# EAGLE design MCU_v2 (EAGLE 7.1.0)
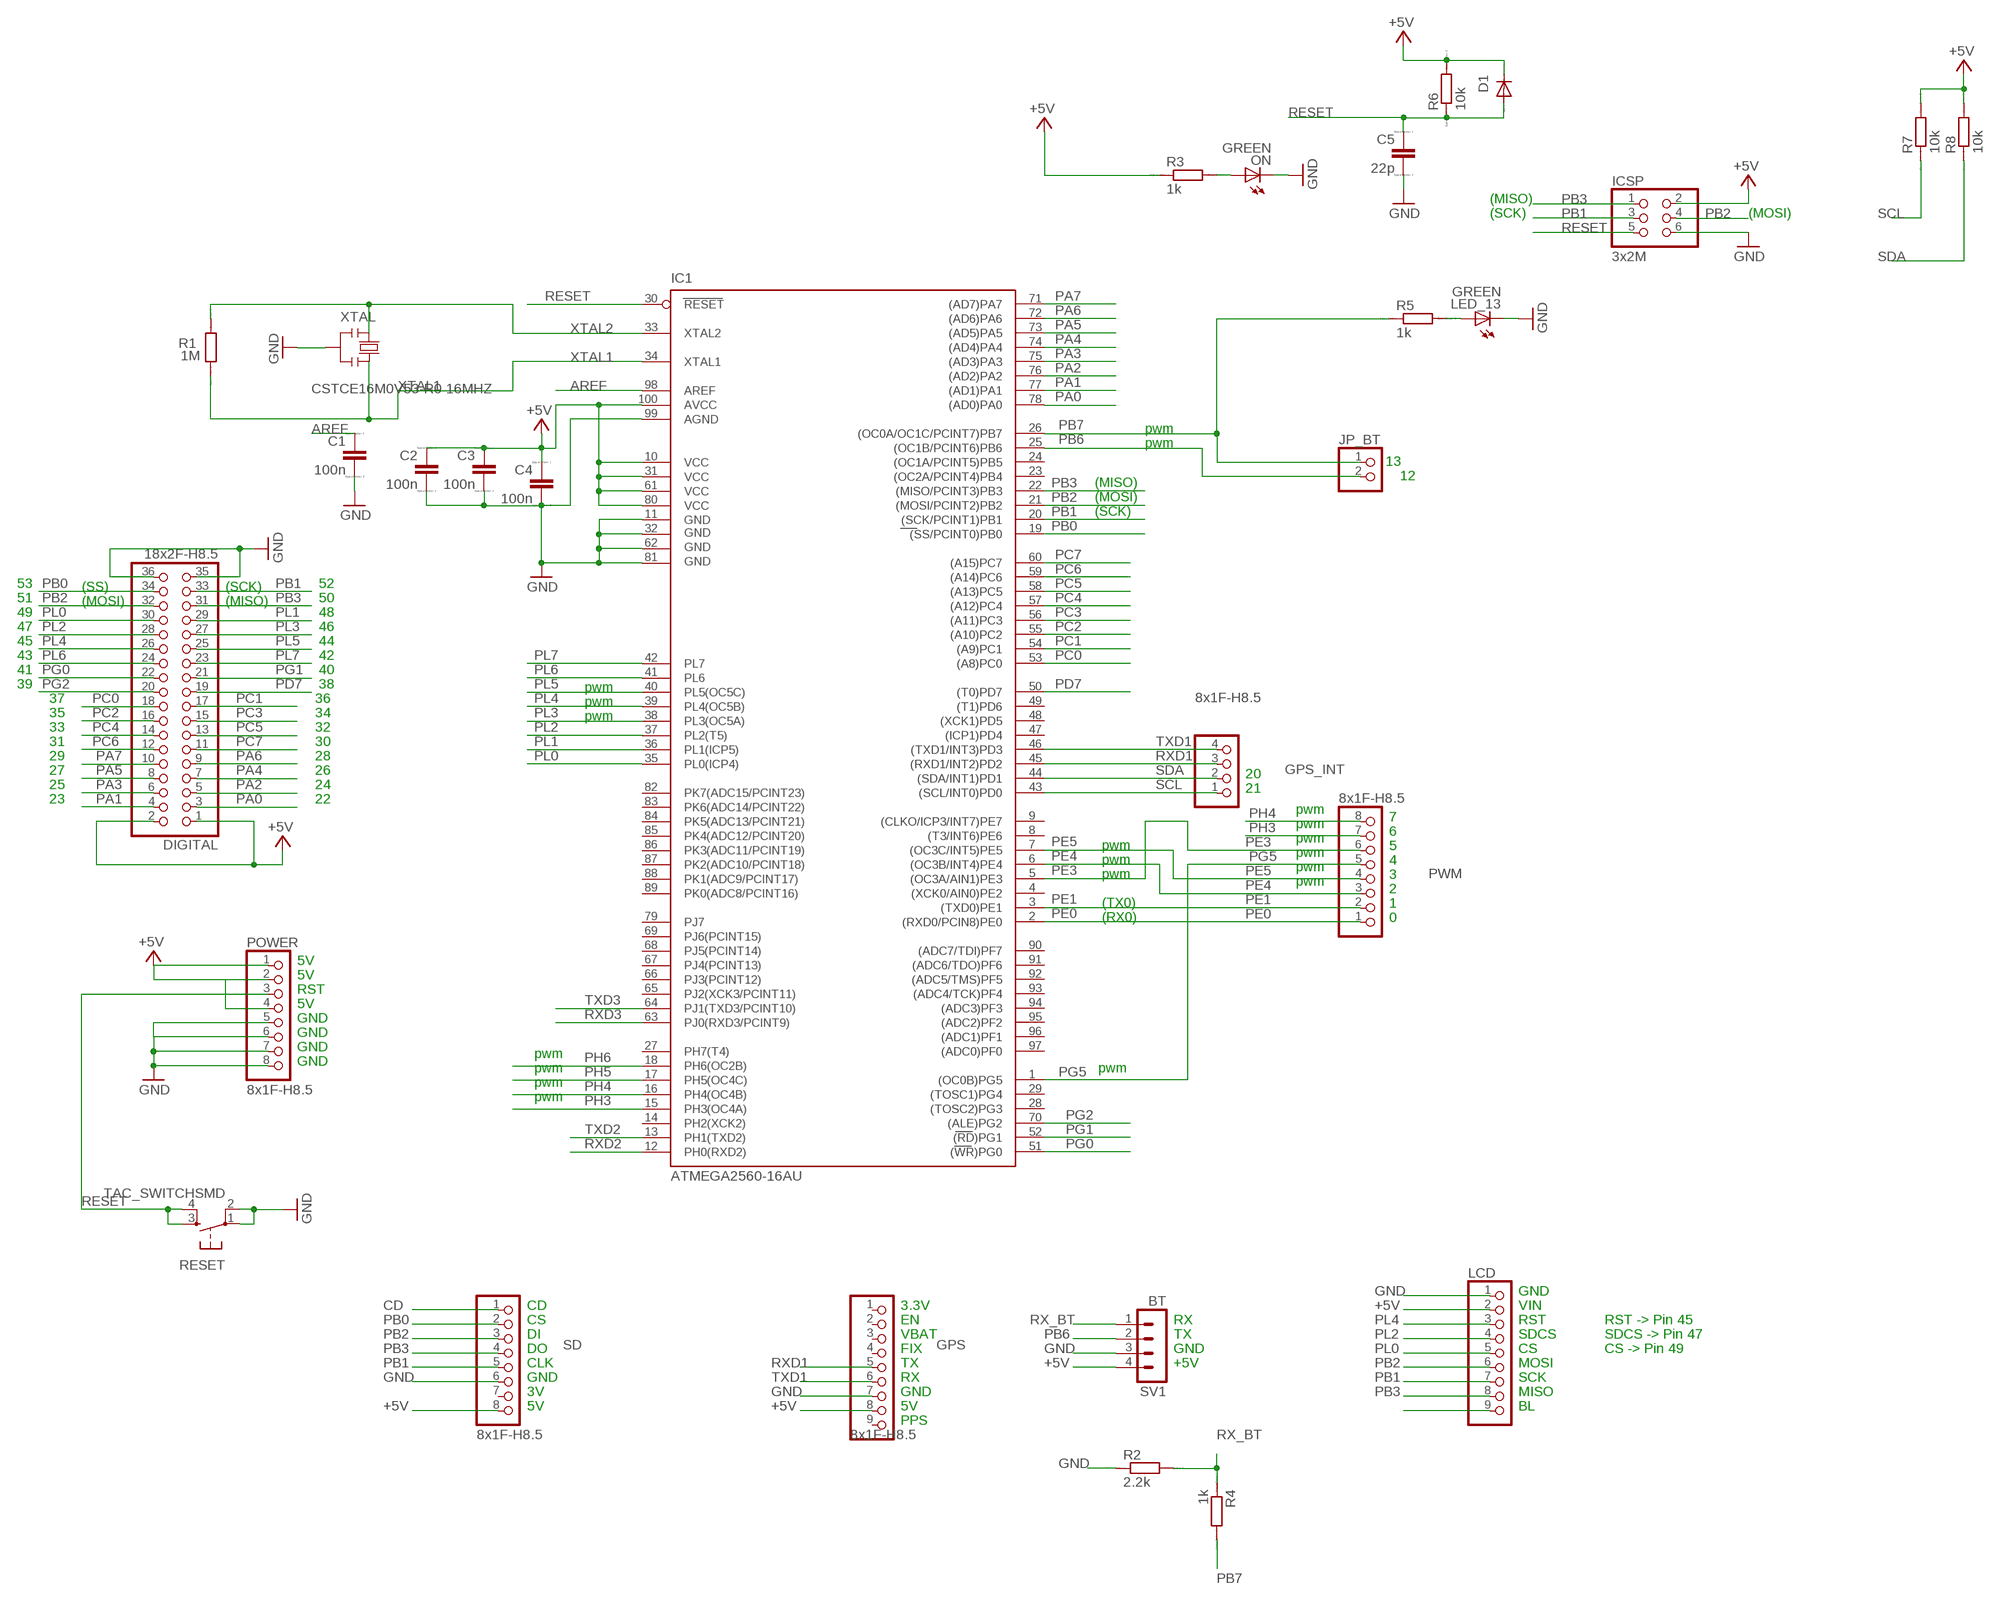
[diagram p0: schematic, sheet 1]

## Parts
C1  100n  C-EUC0805  [C0805]
C2  100n  C-EUC0805  [C0805]
C3  100n  C-EUC0805  [C0805]
C4  100n  C-EUC0805  [C0805]
C5  22p  C-EUC0805  [C0805]
D1  DIODE-MINIMELF  [MINIMELF]
DIGITAL  18x2F-H8.5  PINHD-2X18  [2X18]
GPS  8x1F-H8.5  PINHD-1X9  [1X09]
GPS_INT  8x1F-H8.5  PINHD-1X4  [1X04]
IC1  ATMEGA2560-16AU  ATMEGA25602560-16AU  [TQFP100]
ICSP  3x2M  PINHD-2X3  [2X03]
JP_BT  PINHD-1X2  [1X02]
LCD  PINHD-1X9  [1X09]
LED_13  GREEN  LEDCHIP-LED0805  [CHIP-LED0805]
ON  GREEN  LEDCHIP-LED0805  [CHIP-LED0805]
POWER  8x1F-H8.5  PINHD-1X8  [1X08]
PWM  8x1F-H8.5  PINHD-1X8  [1X08]
R1  1M  R-EU_R0805  [R0805]
R2  2.2k  R-EU_R0805  [R0805]
R3  1k  R-EU_R0805  [R0805]
R4  1k  R-EU_R0805  [R0805]
R5  1k  R-EU_R0805  [R0805]
R6  10k  R-EU_R0805  [R0805]
R7  10k  R-EU_R0805  [R0805]
R8  10k  R-EU_R0805  [R0805]
RESET  TAC_SWITCHSMD  [TACTILE-SWITCH-SMD]
SD  8x1F-H8.5  PINHD-1X8  [1X08]
SV1  BT  MA04-1  [MA04-1]
XTAL  CSTCE16M0V53-R0 16MHZ  RESONATORMU  [RESONATOR]

## Nets
+5V [power usb]: C2.1 C3.1 C4.1 D1.C DIGITAL.1 DIGITAL.2 GPS.8 IC1.10(VCC) IC1.31(VCC1) IC1.61(VCC2) IC1.80(VCC3) IC1.100(AVCC) ICSP.2 LCD.2 POWER.1 POWER.2 POWER.4 R3.1 R6.2 R7.2 R8.2 SD.8 SV1.4
AREF: C1.1 IC1.98(AREF)
CD: SD.1
GND [gnd]: C1.2 C2.2 C3.2 C4.2 C5.2 DIGITAL.35 DIGITAL.36 GPS.7 IC1.11(GND) IC1.32(GND1) IC1.62(GND2) IC1.81(GND3) IC1.99(AGND) ICSP.6 LCD.1 LED_13.C ON.C POWER.5 POWER.6 POWER.7 POWER.8 R2.1 RESET.1 RESET.2 SD.6 SV1.3 XTAL.2
N$1: LED_13.A R5.2
N$3: ON.A R3.2
N$15: LCD.9
PA0: DIGITAL.3 IC1.78((AD0)PA0)
PA1: DIGITAL.4 IC1.77((AD1)PA1)
PA2: DIGITAL.5 IC1.76((AD2)PA2)
PA3: DIGITAL.6 IC1.75((AD3)PA3)
PA4: DIGITAL.7 IC1.74((AD4)PA4)
PA5: DIGITAL.8 IC1.73((AD5)PA5)
PA6: DIGITAL.9 IC1.72((AD6)PA6)
PA7: DIGITAL.10 IC1.71((AD7)PA7)
PB0: DIGITAL.34 IC1.19((SS/PCINT0)PB0) SD.2
PB1: DIGITAL.33 IC1.20((SCK/PCINT1)PB1) ICSP.3 LCD.7 SD.5
PB2: DIGITAL.32 IC1.21((MOSI/PCINT2)PB2) ICSP.4 LCD.6 SD.3
PB3: DIGITAL.31 IC1.22((MISO/PCINT3)PB3) ICSP.1 LCD.8 SD.4
PB6: IC1.25((OC1B/PCINT6)PB6) JP_BT.2 SV1.2
PB7: IC1.26((OC0A/OC1C/PCINT7)PB7) JP_BT.1 R4.2 R5.1
PC0: DIGITAL.18 IC1.53((A8)PC0)
PC1: DIGITAL.17 IC1.54((A9)PC1)
PC2: DIGITAL.16 IC1.55((A10)PC2)
PC3: DIGITAL.15 IC1.56((A11)PC3)
PC4: DIGITAL.14 IC1.57((A12)PC4)
PC5: DIGITAL.13 IC1.58((A13)PC5)
PC6: DIGITAL.12 IC1.59((A14)PC6)
PC7: DIGITAL.11 IC1.60((A15)PC7)
PD7: DIGITAL.19 IC1.50((T0)PD7)
PE0: IC1.2((RXD0/PCIN8)PE0) PWM.1
PE1: IC1.3((TXD0)PE1) PWM.2
PE3: IC1.5((OC3A/AIN1)PE3) PWM.6
PE4: IC1.6((OC3B/INT4)PE4) PWM.3
PE5: IC1.7((OC3C/INT5)PE5) PWM.4
PG0: DIGITAL.22 IC1.51((WR)PG0)
PG1: DIGITAL.21 IC1.52((RD)PG1)
PG2: DIGITAL.20 IC1.70((ALE)PG2)
PG5: IC1.1((OC0B)PG5) PWM.5
PH3: IC1.15(PH3(OC4A)) PWM.7
PH4: IC1.16(PH4(OC4B)) PWM.8
PH5: IC1.17(PH5(OC4C))
PH6: IC1.18(PH6(OC2B))
PL0: DIGITAL.30 IC1.35(PL0(ICP4)) LCD.5
PL1: DIGITAL.29 IC1.36(PL1(ICP5))
PL2: DIGITAL.28 IC1.37(PL2(T5)) LCD.4
PL3: DIGITAL.27 IC1.38(PL3(OC5A))
PL4: DIGITAL.26 IC1.39(PL4(OC5B)) LCD.3
PL5: DIGITAL.25 IC1.40(PL5(OC5C))
PL6: DIGITAL.24 IC1.41(PL6)
PL7: DIGITAL.23 IC1.42(PL7)
RESET: C5.1 D1.A IC1.30(RESET) ICSP.5 POWER.3 R6.1 RESET.3 RESET.4
RX_BT: R2.2 R4.1 SV1.1
RXD1: GPS.5 GPS_INT.3 IC1.45((RXD1/INT2)PD2)
RXD2: IC1.12(PH0(RXD2))
RXD3: IC1.63(PJ0(RXD3/PCINT9))
SCL: GPS_INT.1 IC1.43((SCL/INT0)PD0) R7.1
SDA: GPS_INT.2 IC1.44((SDA/INT1)PD1) R8.1
TXD1: GPS.6 GPS_INT.4 IC1.46((TXD1/INT3)PD3)
TXD2: IC1.13(PH1(TXD2))
TXD3: IC1.64(PJ1(TXD3/PCINT10))
XTAL1: IC1.34(XTAL1) R1.1 XTAL.3
XTAL2: IC1.33(XTAL2) R1.2 XTAL.1
Unconnected: GPS.1 GPS.2 GPS.3 GPS.4 GPS.9 IC1.4((XCK0/AIN0)PE2) IC1.8((T3/INT6)PE6) IC1.9((CLKO/ICP3/INT7)PE7) IC1.14(PH2(XCK2)) IC1.23((OC2A/PCINT4)PB4) IC1.24((OC1A/PCINT5)PB5) IC1.27(PH7(T4)) IC1.28((TOSC2)PG3) IC1.29((TOSC1)PG4) IC1.47((ICP1)PD4) IC1.48((XCK1)PD5) IC1.49((T1)PD6) IC1.65(PJ2(XCK3/PCINT11)) IC1.66(PJ3(PCINT12)) IC1.67(PJ4(PCINT13)) IC1.68(PJ5(PCINT14)) IC1.69(PJ6(PCINT15)) IC1.79(PJ7) IC1.82(PK7(ADC15/PCINT23)) IC1.83(PK6(ADC14/PCINT22)) IC1.84(PK5(ADC13/PCINT21)) IC1.85(PK4(ADC12/PCINT20)) IC1.86(PK3(ADC11/PCINT19)) IC1.87(PK2(ADC10/PCINT18)) IC1.88(PK1(ADC9/PCINT17)) IC1.89(PK0(ADC8/PCINT16)) IC1.90((ADC7/TDI)PF7) IC1.91((ADC6/TDO)PF6) IC1.92((ADC5/TMS)PF5) IC1.93((ADC4/TCK)PF4) IC1.94((ADC3)PF3) IC1.95((ADC2)PF2) IC1.96((ADC1)PF1) IC1.97((ADC0)PF0) SD.7

## Notes on the sheet
- (MISO)
- (SCK) | (MOSI)
- pwm
- pwm
- 13
- 12
- (MISO)
- (MOSI)
- (SCK)
- 53 | (SS) | (SCK) | 52
- 51 | (MOSI) | (MISO) | 50
- 49 | 48
- 47 | 46
- 45 | 44
- 43 | 42
- 41 | 40
- 39 | 38 | pwm
- 37 | 36 | pwm
- 35 | 34 | pwm
- 33 | 32
- 31 | 30
- 29 | 28
- 27 | 26 | 20
- 25 | 24 | 21
- 23 | 22
- pwm
- 7
- pwm
- 6
- pwm
- pwm | 5
- pwm
- pwm | 4
- pwm
- pwm | 3
- pwm
- 2
- (TX0) | 1
- (RX0) | 0
- 5V
- 5V
- RST
- 5V
- GND
- GND
- GND
- pwm
- GND
- pwm | pwm
- pwm
- pwm
- GND
- CD | 3.3V | VIN
- CS | EN | RX | RST | RST -> Pin 45
- DI | VBAT | TX | SDCS | SDCS -> Pin 47
- DO | FIX | GND | CS | CS -> Pin 49
- CLK | TX | +5V | MOSI
- GND | RX | SCK
- 3V | GND | MISO
- 5V | 5V | BL
- PPS

## Library data of the parts
C1-C5 = resistor:C-EU: CAPACITOR, European symbol; SPICEPREFIX: C
D1 = diode:DIODE-: DIODE
DIGITAL = SmartPrj:PINHD-2X18: PIN HEADER
GPS LCD = pinhead:PINHD-1X9: PIN HEADER
GPS_INT = pinhead:PINHD-1X4: PIN HEADER
IC1 = SmartPrj:ATMEGA2560: MICROCONTROLLER 64/128/256 Kbytes FLASH 4 Kbytes EEPROM 8 Kbytes SRAM 86 General Purpose I/O pins 12-channels16-bit PWM 4 x Serial USARTs 16-channels 10-bit A/D
ICSP = SmartPrj:PINHD-2X3: PIN HEADER
JP_BT = pinhead:PINHD-1X2: PIN HEADER
LED_13 ON = led:LED: LED OSRAM: - CHIPLED LG R971, LG N971, LY N971, LG Q971, LY Q971, LO R971, LY R971 LH N974, LH R974 LS Q976, LO Q976, LY Q976 LO Q996 - Hyper CHIPLED LW Q18S LB Q993, LB Q99A, LB R99A - SideLED LS A670, LO A670, LY A670, LG A670, LP A670 LB A673, LV A673, LT A673, LW A673 LH A674 LY A675 LS A676, LA A676, LO A676, LY A676, LW A676 LS A679, LY A679, LG A679 - Hyper Micro SIDELED® LS Y876, LA Y876, LO Y876, LY Y876 LT Y87S - SmartLED LW L88C, LW L88S LB L89C, LB L89S, LG L890 LS L89K, LO L89K, LY L89K LS L896, LA L896, LO L896, LY L896 - TOPLED LS T670, LO T670, LY T670, LG T670, LP T670 LSG T670, LSP T670, LSY T670, LOP T670, LYG T670 LG T671, LOG T671, LSG T671 LB T673, LV T673, LT T673, LW T673 LH T674 LS T676, LA T676, LO T676, LY T676, LB T676, LH T676, LSB T676, LW T676 LB T67C, LV T67C, LT T67C, LS T67K, LO T67K, LY T67K, LW E67C LS E67B, LA E67B, LO E67B, LY E67B, LB E67C, LV E67C, LT E67C LW T67C LS T679, LY T679, LG T679 LS T770, LO T770, LY T770, LG T770, LP T770 LB T773, LV T773, LT T773, LW T773 LH T774 LS E675, LA E675, LY E675, LS T675 LS T776, LA T776, LO T776, LY T776, LB T776 LHGB T686 LT T68C, LB T68C - Hyper Mini TOPLED® LB M676 - Mini TOPLED Santana® LG M470 LS M47K, LO M47K, LY M47K Source: http://www.osram.convergy.de LUXEON: - LUMILED® LXK2-PW12-R00, LXK2-PW12-S00, LXK2-PW14-U00, LXK2-PW14-V00 LXK2-PM12-R00, LXK2-PM12-S00, LXK2-PM14-U00 LXK2-PE12-Q00, LXK2-PE12-R00, LXK2-PE12-S00, LXK2-PE14-T00, LXK2-PE14-U00 LXK2-PB12-K00, LXK2-PB12-L00, LXK2-PB12-M00, LXK2-PB14-N00, LXK2-PB14-P00, LXK2-PB14-Q00 LXK2-PR12-L00, LXK2-PR12-M00, LXK2-PR14-Q00, LXK2-PR14-R00 LXK2-PD12-Q00, LXK2-PD12-R00, LXK2-PD12-S00 LXK2-PH12-R00, LXK2-PH12-S00 LXK2-PL12-P00, LXK2-PL12-Q00, LXK2-PL12-R00 Source: www.luxeon.com KINGBRIGHT: KA-3528ASYC Source: www.kingbright.com
POWER PWM SD = SmartPrj:PINHD-1X8: PIN HEADER
R1-R8 = resistor:R-EU_: RESISTOR, European symbol; SPICEPREFIX: R
RESET = SparkFun-Retired:TAC_SWITCH: Momentary Switch Button commonly used for reset or general input. Spark Fun Electronics SKU : COM-00097 SMT- SWCH-08247; PROD_ID: SWCH-08247
SV1 = con-lstb:MA04-1: PIN HEADER; OC_FARNELL: unknown; OC_NEWARK: unknown
XTAL = SmartPrj:RESONATOR

## Net classes
0 default: width 0.203 mm, drill 0.406 mm, clearance 0.203 mm
1 power: width 0.61 mm, drill 0.406 mm, clearance 0.203 mm
2 gnd: width 0.305 mm, drill 0.406 mm, clearance 0.203 mm
3 power usb: width 0.508 mm, drill 0.406 mm, clearance 0.203 mm

## Board
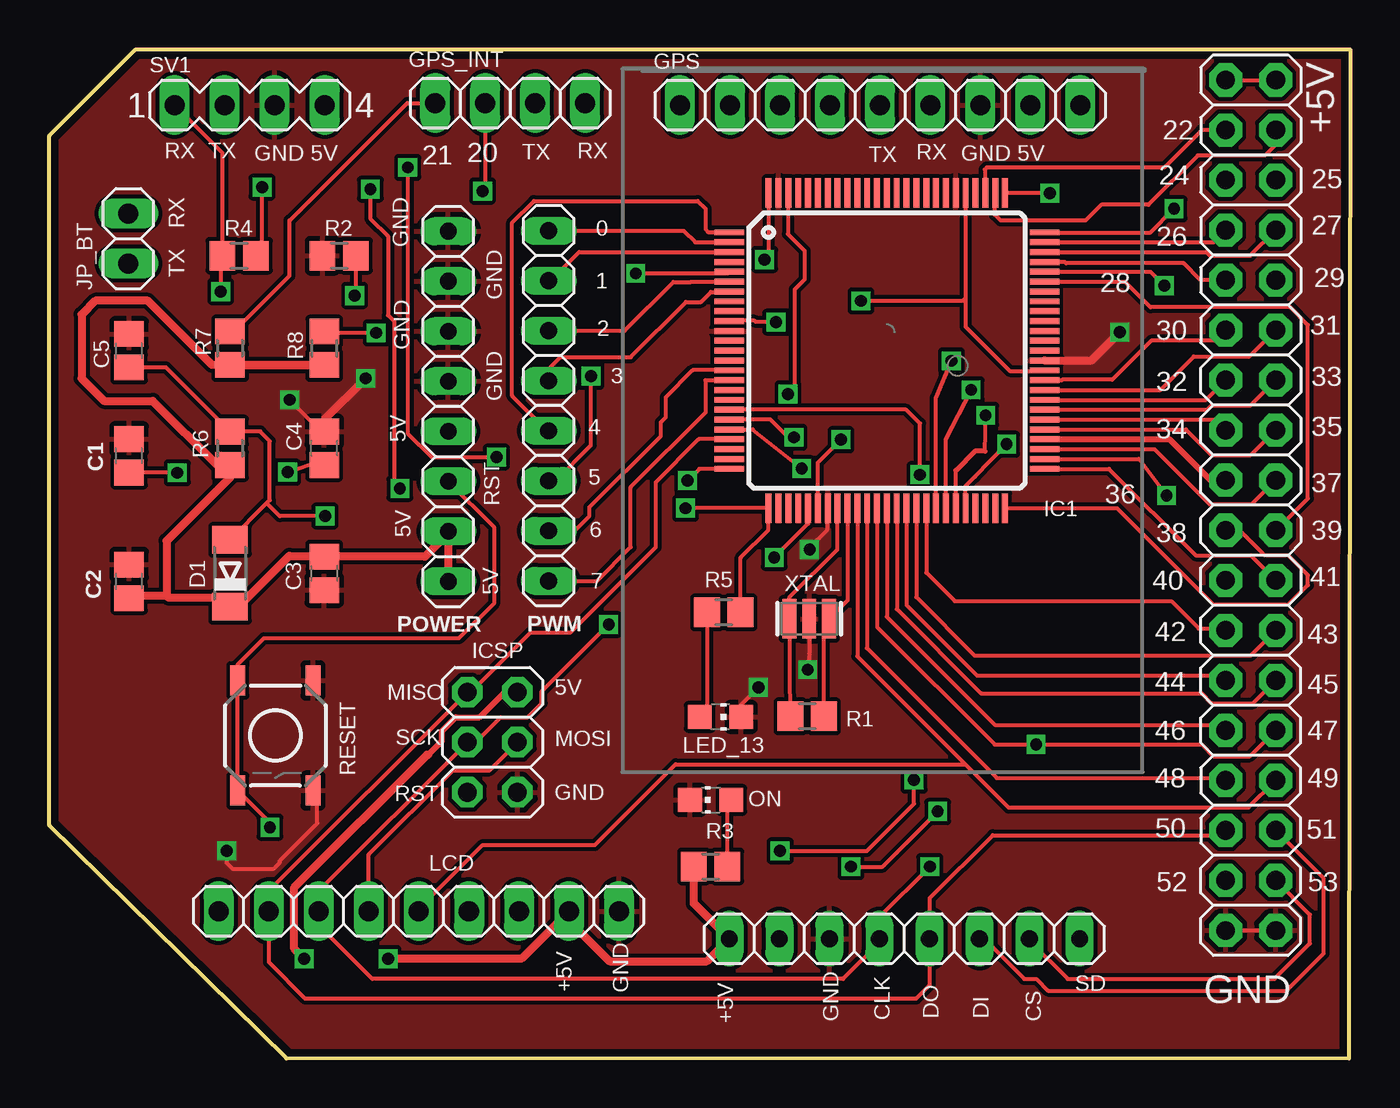
[diagram p1: board, top side]
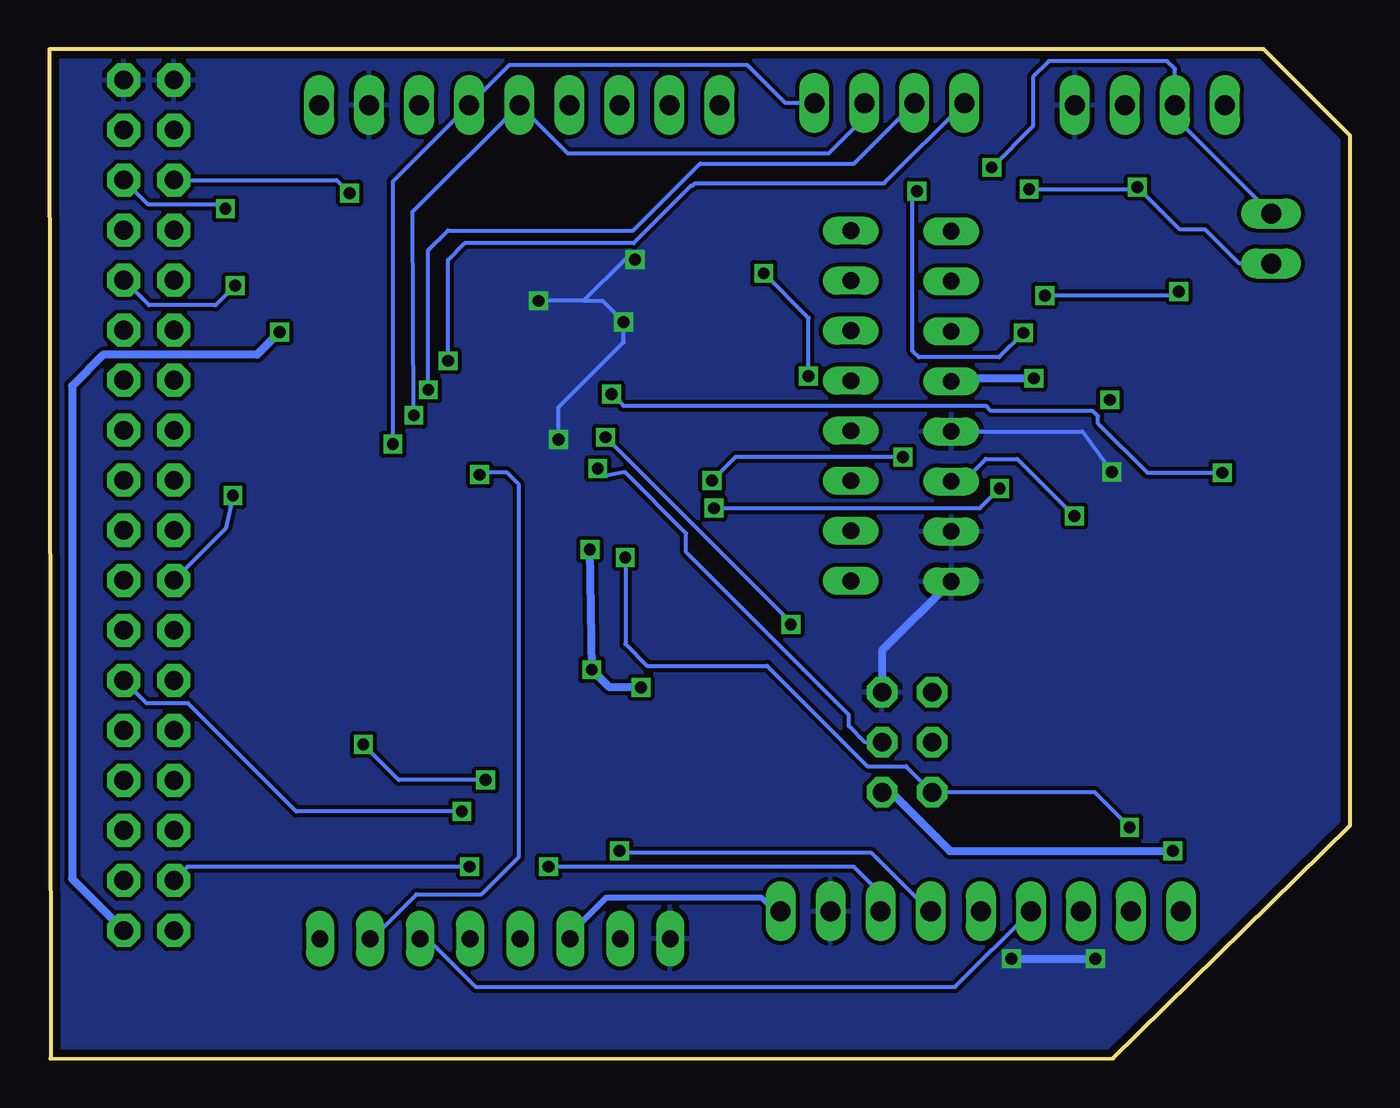
[diagram p2: board, bottom side, seen from below]

Size 66.04 x 51.24 mm. Coordinates in mm from the lower left corner, seen from the top.
Outline: 4.4,51.24 66.04,51.24 65.97,0 12.05,0.01 0,11.84 0,46.84 4.4,51.24
Copper layers (1*16): Top 0.0356mm / dielectric 1.5011mm / Bottom 0.0356mm
Design rules "OSH": minimum track width 6mil, minimum drill 13mil, track to track 6mil, track to pad 6mil, pad to pad 6mil, via to via 6mil, smd to smd 6mil, copper to edge 15mil, drill to drill 6mil, minimum pad ring 7mil, minimum via ring 7mil, stop-mask expansion 3mil, vias tented up to drill 0mil, thermal gap 10mil

### Footprints (pad centres in the part's own frame; a part is rotated, then mirrored left to right if it is on the bottom)
C0805 = smd 1.3 x 1.5: 1 -0.85,0; 2 0.85,0
MINIMELF = smd 1.4 x 1.8: A 1.7,0; C -1.7,0
2X18 = drill 0.95 pad 1.676 octagon: 1 -21.59,-1.27; 2 -21.59,1.27; 3 -19.05,-1.27; 4 -19.05,1.27; 5 -16.51,-1.27; 6 -16.51,1.27; 7 -13.97,-1.27; 8 -13.97,1.27; 9 -11.43,-1.27; 10 -11.43,1.27; 11 -8.89,-1.27; 12 -8.89,1.27; 13 -6.35,-1.27; 14 -6.35,1.27; 15 -3.81,-1.27; 16 -3.81,1.27; 17 -1.27,-1.27; 18 -1.27,1.27; 19 1.27,-1.27; 20 1.27,1.27; 21 3.81,-1.27; 22 3.81,1.27; 23 6.35,-1.27; 24 6.35,1.27; 25 8.89,-1.27; 26 8.89,1.27; 27 11.43,-1.27; 28 11.43,1.27; 29 13.97,-1.27; 30 13.97,1.27; 31 16.51,-1.27; 32 16.51,1.27; 33 19.05,-1.27; 34 19.05,1.27; 35 21.59,-1.27; 36 21.59,1.27
1X09 = drill 1.016 long: 1 -10.16,0; 2 -7.62,0; 3 -5.08,0; 4 -2.54,0; 5 0,0; 6 2.54,0; 7 5.08,0; 8 7.62,0; 9 10.16,0
1X04 = drill 1.016 long: 1 -3.81,0; 2 -1.27,0; 3 1.27,0; 4 3.81,0
TQFP100 = smd 1.5 x 0.3: 1 -8,6; 2 -8,5.5; 3 -8,5; 4 -8,4.5; 5 -8,4; 6 -8,3.5; 7 -8,3; 8 -8,2.5; 9 -8,2; 10 -8,1.5; 11 -8,1; 12 -8,0.5; 13 -8,0; 14 -8,-0.5; 15 -8,-1; 16 -8,-1.5; 17 -8,-2; 18 -8,-2.5; 19 -8,-3; 20 -8,-3.5; 21 -8,-4; 22 -8,-4.5; 23 -8,-5; 24 -8,-5.5; 25 -8,-6; 51 8,-6; 52 8,-5.5; 53 8,-5; 54 8,-4.5; 55 8,-4; 56 8,-3.5; 57 8,-3; 58 8,-2.5; 59 8,-2; 60 8,-1.5; 61 8,-1; 62 8,-0.5; 63 8,0; 64 8,0.5; 65 8,1; 66 8,1.5; 67 8,2; 68 8,2.5; 69 8,3; 70 8,3.5; 71 8,4; 72 8,4.5; 73 8,5; 74 8,5.5; 75 8,6 | smd 0.3 x 1.5: 26 -6,-8; 27 -5.5,-8; 28 -5,-8; 29 -4.5,-8; 30 -4,-8; 31 -3.5,-8; 32 -3,-8; 33 -2.5,-8; 34 -2,-8; 35 -1.5,-8; 36 -1,-8; 37 -0.5,-8; 38 0,-8; 39 0.5,-8; 40 1,-8; 41 1.5,-8; 42 2,-8; 43 2.5,-8; 44 3,-8; 45 3.5,-8; 46 4,-8; 47 4.5,-8; 48 5,-8; 49 5.5,-8; 50 6,-8; 76 6,8; 77 5.5,8; 78 5,8; 79 4.5,8; 80 4,8; 81 3.5,8; 82 3,8; 83 2.5,8; 84 2,8; 85 1.5,8; 86 1,8; 87 0.5,8; 88 0,8; 89 -0.5,8; 90 -1,8; 91 -1.5,8; 92 -2,8; 93 -2.5,8; 94 -3,8; 95 -3.5,8; 96 -4,8; 97 -4.5,8; 98 -5,8; 99 -5.5,8; 100 -6,8
2X03 = drill 0.95 pad 1.55 octagon: 1 -2.54,-1.27; 2 -2.54,1.27; 3 0,-1.27; 4 0,1.27; 5 2.54,-1.27; 6 2.54,1.27
1X02 = drill 1.016 long: 1 -1.27,0; 2 1.27,0
CHIP-LED0805 = smd 1.2 x 1.2: A 0,-1.05; C 0,1.05
1X08 = drill 0.85 pad 1.422 long: 1 -8.89,0; 2 -6.35,0; 3 -3.81,0; 4 -1.27,0; 5 1.27,0; 6 3.81,0; 7 6.35,0; 8 8.89,0
R0805 = smd 1.3 x 1.5: 1 -0.85,0; 2 0.85,0
TACTILE-SWITCH-SMD = smd 1.524 x 0.762: 1 -2.794,1.905; 2 2.794,1.905; 3 -2.794,-1.905; 4 2.794,-1.905
MA04-1 = drill 1.016 long: 1 -3.81,0; 2 -1.27,0; 3 1.27,0; 4 3.81,0
RESONATOR = smd 0.7 x 2: 1 -1,0; 2 0,0; 3 1,0

### Placement (x,y rotation side)
C1  4.05,30.6 90 top
C2  4.05,24.23 90 top
C3  13.96,24.64 270 top
C4  13.96,30.99 90 top
C5  4.05,35.94 90 top
D1  9.18,24.64 90 top
DIGITAL  60.99,28.09 270 top
GPS  42.18,48.41 0 top
GPS_INT  23.4,48.51 0 top
IC1  42.52,35.94 0 top
ICSP  22.49,16.06 270 top
JP_BT  4.01,41.63 90 top
LCD  18.76,7.48 180 top
LED_13  34.07,17.34 270 top
ON  33.58,13.13 90 top
POWER  20.25,33.12 90 top
PWM  25.35,33.14 270 top
R1  38.48,17.38 180 top
R2  14.72,40.76 0 top
R3  33.58,9.75 0 top
R4  9.64,40.76 0 top
R5  34.24,22.65 180 top
R6  9.18,30.99 270 top
R7  9.18,36.07 270 top
R8  13.96,36.07 270 top
RESET  11.48,16.4 270 top
SD  43.41,6.08 180 top
SV1  10.17,48.41 0 top
XTAL  38.58,22.33 0 top

### Tracks (layer width: path | path; a pad name or v marks a point on that pad's centre or on a via)
+5V  (via drill 0.6)
  Top 0.203: 46.5,43.96 IC1.80 | 8.74,23.38 D1.C | DIGITAL.1 DIGITAL.2 | v12.1,29.77 13.75,30.34 C4.1 | IC1.31 39.02,30.26 v40.19,31.42 | 34.57,37.39 IC1.10 34.53,37.46 35.81,37.46 35.87,37.39 v36.89,37.39 | IC1.100 36.52,40.77 v36.32,40.57 | GPS.8 49.56,48.41 | 46.47,43.99 IC1.80 | IC1.80 46.52,38.6 | 46.52,38.6 46.52,37.16 48.76,34.92 50.49,34.92 IC1.61 | v41.2,38.47 46.39,38.47 46.52,38.6
  Top 0.305: 19.23,15.42 19.93,16.12 19.93,16.63 20.63,17.33 21.84,17.33 23.11,18.6 ICSP.2
  Top 0.406: R3.1 32.73,7.88 SD.8 33.38,4.94 28.44,4.94 26.38,7 LCD.2 23.97,5.07 v17.2,5.07 | v12.95,5.07 12.44,5.58 12.44,8.69 19.17,15.42 19.23,15.42 | POWER.1 POWER.2 20.25,26.66 19.07,25.49 C3.1 13.93,25.52 12.18,25.52 9.6,22.94 D1.C 8.69,23.42 6.02,23.42 5.96,23.49 | 5.96,23.49 5.96,26.28 9.18,29.5 R6.2 8.52,30.14 5.26,33.39 2.79,33.39 1.64,34.53 1.64,37.77 2.34,38.47 5.01,38.47 8.27,35.22 R8.2 R7.2 | 5.96,23.49 4.16,23.49 C2.1
  Bottom 0.203: POWER.4 13.6,31.85 v12.1,29.77 | v40.19,31.42 40.19,33.07 36.89,36.38 v36.89,37.39 37.96,38.47 38.92,38.47 | v36.32,40.57 36.82,40.57 38.92,38.47 | 38.92,38.47 v41.2,38.47
  Bottom 0.406: v17.2,5.07 v12.95,5.07 | POWER.1 23.76,20.72 ICSP.2
  pour Bottom: -0.6,52.24 66.1,52.24 66.1,-0.26 -0.6,-0.26
AREF  (via drill 0.6)
  Top 0.203: IC1.98 37.5,43.92 37.5,41.86 38.35,41.01 38.35,39.55 37.84,39.04 37.84,34.08 v37.5,33.74 | v6.5,29.74 4.06,29.74 C1.1
  Bottom 0.203: v37.5,33.74 36.9,33.14 18.5,33.14 18.24,32.88 13.07,32.88 12.8,32.61 12.8,32.24 10.3,29.74 v6.5,29.74
GND  (via drill 0.6)
  Top 0.203: XTAL.2 38.58,20.56 v38.5,19.74 | v38.6,25.84 38.6,25.94 39.5,26.84 39.5,27.92 IC1.32 | DIGITAL.35 DIGITAL.36 | LED_13.C 35.12,17.96 v36,18.84 | v9,10.54 9,9.94 9.3,9.64 11.4,9.64 11.7,9.94 11.7,10.04 13.6,11.94 13.6,13.4 RESET.2 | C4.2 13.81,31.84 v12.2,33.44
  Top 0.406: IC1.62 52.91,35.44 v54.35,36.88 | C4.2 13.96,32.44 v16.06,34.53
  Bottom 0.203: ICSP.6 23.76,13.61 | 20.1,34.54 POWER.5
  Bottom 0.305: 39.6,6.34 37.76,8.18 29.9,8.18 29.2,7.48 LCD.1
  Bottom 0.406: v38.6,25.84 v38.5,19.74 37.6,18.84 v36,18.84 | v54.35,36.88 55.49,35.74 63.3,35.74 64.89,34.15 64.89,9.13 DIGITAL.36 | v16.06,34.53 20.11,34.53 POWER.5 | ICSP.6 23.3,13.52 20.33,10.54 v9,10.54
  pour Top: -1.3,51.94 66.2,51.94 66.2,-1.56 -1.3,-1.56
N$1
  Top 0.203: R5.2 33.39,17.72 LED_13.A
N$3
  Top 0.203: R3.2 34.43,12.93 ON.A
PA0
  Top 0.203: DIGITAL.3 58.5,47.14 56.6,45.24 47.6,45.24 47.49,45.14 47.49,43.97 IC1.78
PA1
  Top 0.203: DIGITAL.4 62.26,46.4 61.7,45.84 58.3,45.84 55.8,43.34 53.4,43.34 52.6,42.54 48.3,42.54 48,42.84 48,43.92 IC1.77
PA2  (via drill 0.6)
  Top 0.203: v50.8,43.94 IC1.76
  Bottom 0.203: DIGITAL.5 51.46,44.6 v50.8,43.94
PA3  (via drill 0.6)
  Top 0.203: IC1.75 55.9,41.94 v57.1,43.14
  Bottom 0.203: v57.1,43.14 57.12,43.14 57.33,43.36 61.02,43.36 DIGITAL.6
PA4
  Top 0.203: IC1.74 59.1,41.44 DIGITAL.7
PA5
  Top 0.203: IC1.73 58.73,40.94 58.92,40.76 60.95,40.76 DIGITAL.8
PA6
  Top 0.203: DIGITAL.9 58.44,39.52 57.59,40.38 51.62,40.38 51.55,40.44 IC1.72
PA7  (via drill 0.6)
  Top 0.203: IC1.71 55.9,39.94 v56.6,39.24
  Bottom 0.203: v56.6,39.24 57.6,38.24 60.98,38.24 DIGITAL.10
PB0  (via drill 0.6)
  Top 0.203: SD.2 49.76,5.98 51.7,4.04 62.2,4.04 64,5.84 64,7.3 DIGITAL.34 | v44.2,29.64 44.2,32.24 43.5,32.94 IC1.19
  Bottom 0.203: SD.2 49.66,6.08 47.4,8.34 44.1,8.34 42.2,10.24 42.2,29.14 42.8,29.74 44.1,29.74 v44.2,29.64
PB1  (via drill 0.6)
  Top 0.203: v44.7,9.74 42.14,7.19 SD.5 42.14,5.89 40.3,4.04 16.4,4.04 13.68,6.76 LCD.7 13.68,8.52 ICSP.3 21.65,16.06 22.92,17.33 24.28,17.33 25,18.04 25,18.64 v28.4,22.04 | v37.8,31.54 37.5,31.54 36.6,32.44 IC1.20
  Bottom 0.203: v44.7,9.74 59.02,9.74 DIGITAL.33 | v28.4,22.04 28.4,22.14 v37.8,31.54
PB2  (via drill 0.6)
  Top 0.203: SD.3 47.46,6.08 49.5,4.04 50.1,4.04 50.7,3.44 62.8,3.44 64.7,5.34 64.7,9.14 DIGITAL.32 | LCD.6 16.22,10.36 20.5,14.64 22.35,14.64 ICSP.4 | IC1.21 35.7,31.94 v38.2,29.95
  Bottom 0.203: SD.3 46.84,6.08 44.4,3.64 20.06,3.64 LCD.6 | ICSP.4 24.63,16.06 25.46,16.88 25.46,17.45 33.71,25.71 33.71,26.66 36.82,29.77 37.83,29.58 v38.2,29.95
PB3
  Top 0.203: DIGITAL.31 59.48,11.34 47.9,11.34 44.68,8.13 SD.4 44.68,3.73 44,3.04 13,3.04 11.14,4.9 LCD.8 11.14,8.52 ICSP.1 21.4,18.6 24.44,21.64 26.47,21.64 30.79,25.96 30.79,29.26 32.97,31.44 IC1.22
PB6  (via drill 0.6)
  Top 0.203: v18.2,45.24 18.2,31.74 19.4,30.54 v22.7,30.54 | IC1.25 33,29.94 v32.4,29.34
  Bottom 0.203: JP_BT.2 8.9,47.79 SV1.2 8.9,50.24 9.3,50.64 15.3,50.64 16.1,49.84 16.1,47.34 v18.2,45.24 | v22.7,30.54 31.2,30.54 v32.4,29.34
PB7  (via drill 0.6)
  Top 0.203: R4.2 10.8,41.07 v10.8,44.24 | v32.3,27.94 IC1.26 36.5,27.92 36.5,26.84 35.09,25.44 R5.1 | v16.3,44.14 16.3,42.64 17.2,41.74 17.2,37.74 17.5,37.44 17.5,29.24 v17.8,28.94
  Bottom 0.203: v32.3,27.94 18.8,27.94 v17.8,28.94 | v16.3,44.14 10.9,44.14 v10.8,44.24 8.65,42.09 7.36,42.09 5.63,40.36 JP_BT.1
PC0
  Top 0.203: IC1.53 56.1,30.94 58.9,28.14 61.04,28.14 DIGITAL.18
PC1
  Top 0.305: IC1.54 56.87,31.44 58.95,29.36 DIGITAL.17
PC2
  Top 0.203: IC1.55 57.7,31.94 59,30.64 61,30.64 DIGITAL.16
PC3
  Top 0.203: IC1.56 59.18,32.44 DIGITAL.15
PC4
  Top 0.203: IC1.57 58.8,32.94 59,33.14 60.96,33.14 DIGITAL.14
PC5
  Top 0.203: IC1.58 58.72,33.44 DIGITAL.13
PC6
  Top 0.203: IC1.59 56.4,33.94 58.1,35.64 60.92,35.64 DIGITAL.12
PC7
  Top 0.203: IC1.60 51.4,34.44 51.43,34.47 53.97,34.47 55.94,36.44 59.18,36.44 DIGITAL.11
PD7
  Top 0.203: IC1.50 54.2,27.94 59.1,23.04 62.9,23.04 63.9,24.04 63.9,24.54 62.9,25.54 61.7,25.54 60.4,26.84 59.74,26.84 DIGITAL.19
PE0
  Top 0.203: PWM.1 32.21,42.03 32.8,41.44 IC1.2
PE1
  Top 0.203: PWM.2 25.45,39.49 26.9,40.94 IC1.3
PE3  (via drill 0.6)
  Top 0.203: PWM.6 25.69,29.33 27.5,31.14 v27.5,34.64 | v29.77,39.87 34.44,39.87 IC1.5
  Bottom 0.203: v27.5,34.64 27.5,37.59 v29.77,39.87
PE4
  Top 0.203: PWM.3 29.21,36.95 31.68,39.42 32.57,39.42 32.59,39.44 IC1.6
PE5
  Top 0.203: PWM.4 25.35,35 25.96,35.61 29.52,35.61 32.31,38.41 33.08,38.41 33.58,38.92 34.49,38.92 IC1.7
PG0
  Top 0.203: IC1.51 53.8,29.94 58.2,25.54 61,25.54 DIGITAL.22
PG1  (via drill 0.6)
  Top 0.203: IC1.52 55.3,30.44 v56.72,28.58
  Bottom 0.203: v56.72,28.58 57.1,26.9 DIGITAL.21
PG2
  Top 0.203: DIGITAL.20 62.28,26.82 63.9,28.44 63.9,37.24 63,38.14 55.9,38.14 54.6,39.44 IC1.70
PG5
  Top 0.203: PWM.5 25.27,31.87 23.5,33.64 23.5,42.44 24.6,43.54 32.92,43.54 33.33,43.13 33.33,42.09 33.48,41.94 IC1.1
PH3
  Top 0.203: IC1.15 32.66,34.94 31.3,33.58 31.3,32.57 31.04,32.31 31.04,31.61 27.43,27.99 27.43,27.55 26.67,26.79 PWM.7
PH4
  Top 0.203: IC1.16 33.3,34.44 33.33,34.41 33.33,32.82 29.52,29.01 29.52,25.96 27.81,24.25 PWM.8
PL0
  Top 0.203: IC1.35 41.02,20.42 46.5,14.94 | 46.5,14.94 48.7,12.74 60.88,12.74 DIGITAL.30 | LCD.5 18.76,7.6 22,10.84 27.7,10.84 31.8,14.94 46.5,14.94
PL1
  Top 0.203: IC1.36 41.52,28.22 41.5,28.24 41.5,20.84 48.1,14.24 59.6,14.24 DIGITAL.29
PL2  (via drill 0.6)
  Top 0.203: IC1.37 42.02,21.92 48,15.94 49.8,15.94 v50.1,15.94 58.5,15.94 59.1,15.34 60.94,15.34 DIGITAL.28 | v37.1,10.54 41.5,10.54 43.9,12.94 v43.9,14.14
  Bottom 0.203: LCD.4 21.34,7.48 24.3,10.44 37,10.44 v37.1,10.54 | v43.9,14.14 48.3,14.14 v50.1,15.94
PL3
  Top 0.203: IC1.38 42.52,22.42 48,16.94 59.44,16.94 DIGITAL.27
PL4  (via drill 0.6)
  Top 0.203: IC1.39 43.02,22.82 47.3,18.54 58.5,18.54 59,18.04 61.1,18.04 DIGITAL.26 | v40.7,9.74 42.3,9.74 v45.1,12.54
  Bottom 0.203: LCD.3 23.9,7.54 23.9,8.44 25.2,9.74 v40.7,9.74 | v45.1,12.54 53.5,12.54 59,18.04 61.1,18.04 DIGITAL.26
PL5
  Top 0.203: IC1.40 43.52,23.02 47.1,19.44 59.48,19.44 DIGITAL.25
PL6
  Top 0.203: IC1.41 44.02,23.42 47,20.44 60.96,20.44 DIGITAL.24
PL7
  Top 0.203: IC1.42 44.52,24.68 45.97,23.23 56.95,23.23 58.35,21.84 59.63,21.84 DIGITAL.23
RESET  (via drill 0.6)
  Top 0.203: v11.2,11.74 11.2,11.99 RESET.4 RESET.3 9.58,20.02 10.9,21.34 20.8,21.34 22.6,23.14 22.6,26.96 POWER.3 | D1.A 11.04,28.2 | 11.04,28.2 11.2,28.36 11.2,31.34 10.71,31.84 R6.1 5.93,35.09 C5.1 | v14,27.54 11.7,27.54 11.04,28.2 | IC1.30 38.52,27.16 v36.8,25.44
  Bottom 0.203: v11.2,11.74 12.98,13.52 ICSP.5 22.55,14.84 24.5,14.84 29.6,19.94 35.7,19.94 36.8,21.04 v36.8,25.44 | POWER.3 19.64,29.31 18.5,30.44 16.9,30.44 v14,27.54
RX_BT  (via drill 0.6)
  Top 0.203: SV1.1 8.79,45.98 R4.1 8.7,40.67 v8.7,38.94 | v15.5,38.74 15.57,38.81 R2.2
  Bottom 0.203: v8.7,38.94 8.9,38.74 v15.5,38.74
RXD1  (via drill 0.6)
  Top 0.203: IC1.45 46.02,29.86 | 47.5,30.84 v47.54,32.66
  Top 0.254: 47.5,30.84 47,30.84 46.02,29.86
  Bottom 0.203: 43,47.59 GPS.5 | GPS_INT.3 24.67,47.77 26.5,45.94 39.71,45.94 GPS.5 | v47.54,32.66 47.6,42.99 GPS.5
SCL  (via drill 0.6)
  Top 0.203: IC1.43 45,27.96 45,33.54 v45.8,35.42 | R7.1 9.41,37.14 9.6,37.14 12.2,39.74 12.2,42.54 18.17,48.51 GPS_INT.1
  Bottom 0.203: v45.8,35.42 45.8,40.54 44.95,41.39 36.38,41.39 33.46,44.31 33.39,44.31 33.26,44.44 23.66,44.44 GPS_INT.1
SDA  (via drill 0.6)
  Top 0.203: IC1.44 45.52,31.46 v46.8,33.95 | GPS_INT.2 22.13,44.17 v22,44.04 | v16.6,36.84 14.03,36.84 R8.1
  Bottom 0.203: v46.8,33.95 46.8,41.04 45.8,42.04 36.4,42.04 33,45.44 25.2,45.44 GPS_INT.2 | v16.6,36.84 17.83,35.61 21.9,35.61 22.22,35.93 22.22,43.83 v22,44.04
TXD1  (via drill 0.6)
  Top 0.203: IC1.46 46.52,29.06 47,29.54 v48.6,31.2
  Bottom 0.203: GPS_INT.4 28.67,48.51 30.6,50.44 42.69,50.44 GPS.6 48.6,44.53 v48.6,31.2
XTAL1
  Top 0.203: R1.1 39.33,22.08 XTAL.3 40.52,23.27 IC1.34
XTAL2
  Top 0.203: IC1.33 40,27.92 40,25.84 37.58,23.42 XTAL.1 37.58,18.93 R1.2

### Text on the board
tPlace: 22 | +5V | RX | TX | GND | 5V | 21 | 20 | TX | RX | TX | RX | GND | 5V | 24 | 25 | RX | GND | 0 | 26 | 27 | TX | 1 | 29 | GND | 28 | 2 | 30 | 31 | GND | 3 | 33 | GND | 32 | 5V | 4 | 34 | 35 | 5 | RST | 36 | 37 | 5V | 6 | 38 | 39 | 5V | 7 | 40 | 41 | 42 | 43 | MISO | 5V | 44 | 45 | 46 | 47 | SCK | MOSI | RST | GND | 48 | 49 | 50 | 51 | 52 | 53 | +5V | GND | GND | +5V | GND | CLK | DO | DI | CS